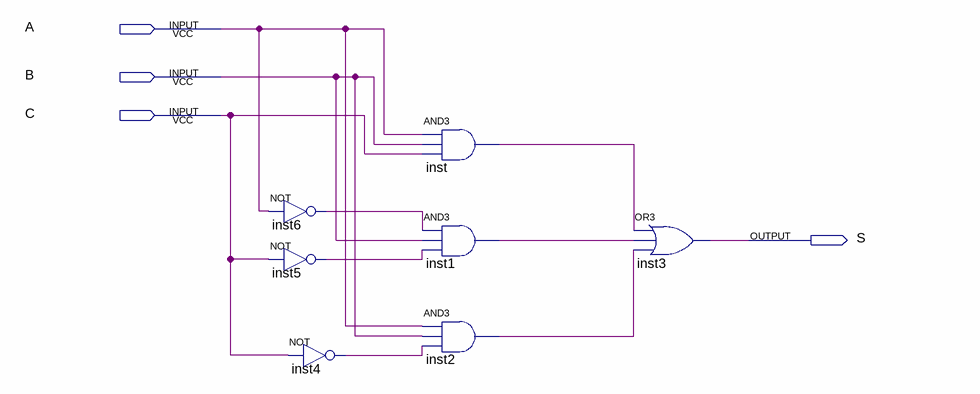
[diagram p0: schematic sheet]
// Quartus schematic EX1_portalogica.bdf as structural Verilog: 7 symbols, 4 pins
module EX1_portalogica (
  input  A,
  input  B,
  input  C,
  output S
);

  wire inst1_out, inst2_out, inst4_out, inst5_out, inst6_out, inst_out;

  not inst6 (inst6_out, A);
  not inst5 (inst5_out, C);
  not inst4 (inst4_out, C);
  and inst (inst_out, A, B, C);
  and inst1 (inst1_out, inst6_out, B, inst5_out);
  and inst2 (inst2_out, A, B, inst4_out);
  or inst3 (S, inst_out, inst1_out, inst2_out);
endmodule
